# Altium schematic sheet GE-PHY.SchDoc
size A4
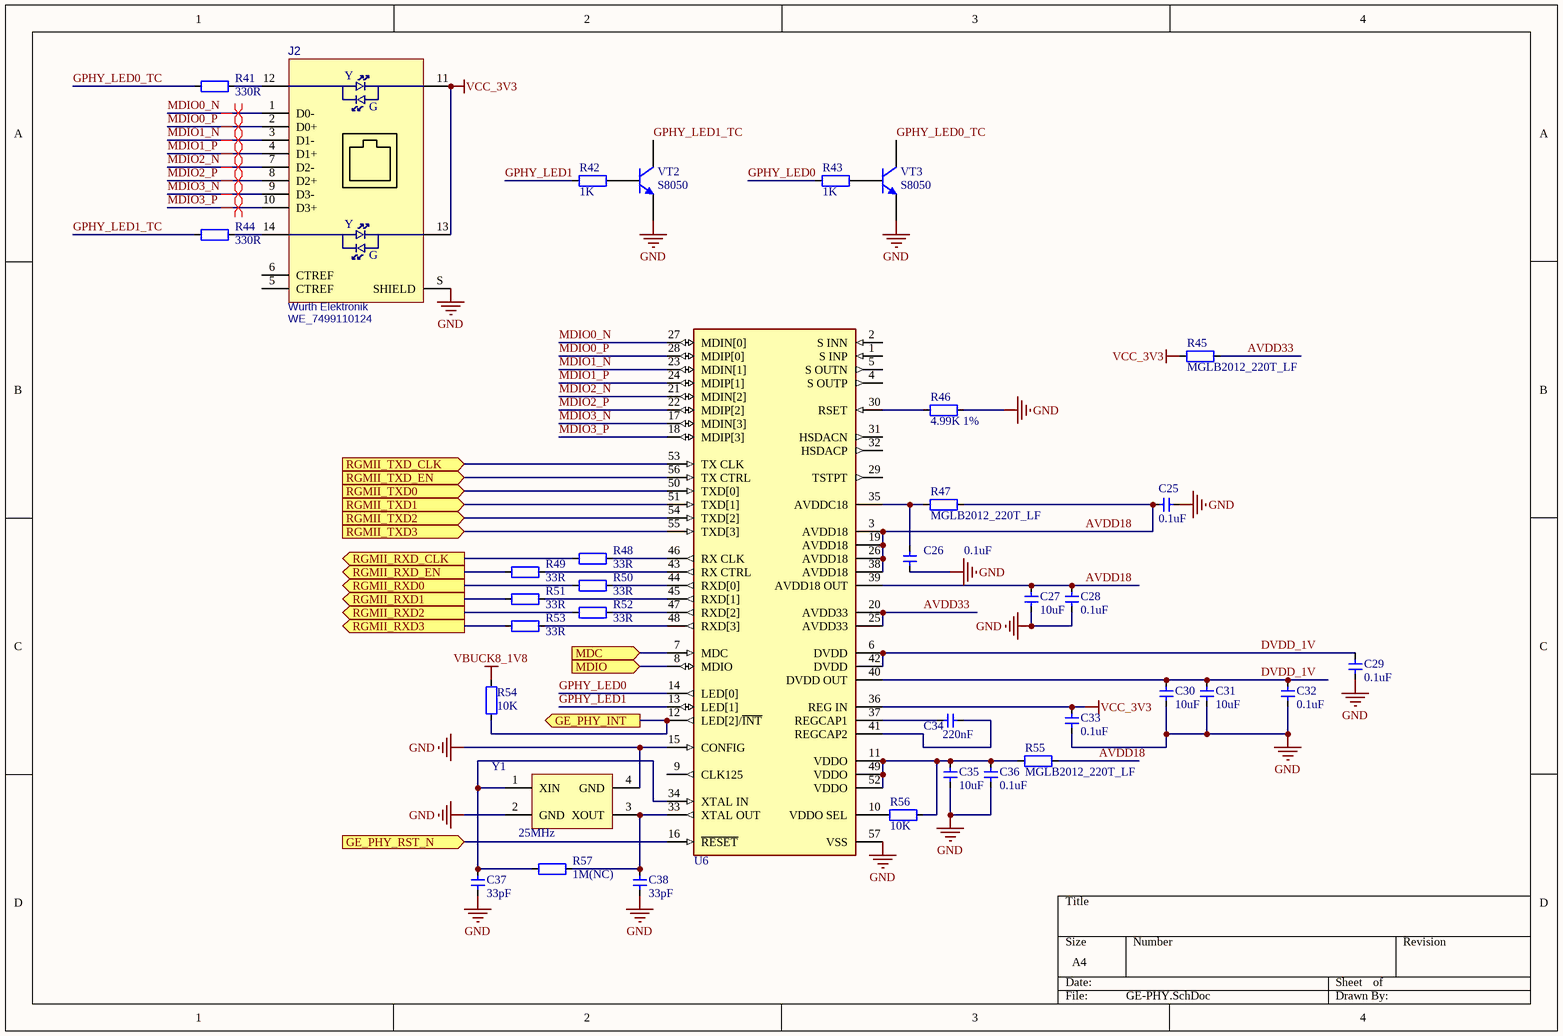
[diagram p0: GE-PHY.SchDoc]

## Parts
C25  0.1uF  [CAP_0402]
C26  0.1uF  [CAP_0402]
C27  10uF  [CAP_0402]
C28  0.1uF  [CAP_0402]
C29  0.1uF  [CAP_0402]
C30  10uF  [CAP_0402]
C31  10uF  [CAP_0402]
C32  0.1uF  [CAP_0402]
C33  0.1uF  [CAP_0402]
C34  220nF  [CAP_0402]
C35  10uF  [CAP_0402]
C36  0.1uF  [CAP_0402]
C37  33pF  [CAP_0402]
C38  33pF  [CAP_0402]
J2  Manufacturer: Wurth Elektronik  [GE-SOCKET]  (hidden comment: WE_7499110124)
R41  330R  [RES_0402]
R42  1K  [RES_0402]
R43  1K  [RES_0402]
R44  330R  [RES_0402]
R45  MGLB2012_220T_LF  [0805-L]
R46  4.99K 1%  [RES_0402]
R47  MGLB2012_220T_LF  [0805-L]
R48  33R  [RES_0402]
R49  33R  [RES_0402]
R50  33R  [RES_0402]
R51  33R  [RES_0402]
R52  33R  [RES_0402]
R53  33R  [RES_0402]
R54  10K  [RES_0402]
R55  MGLB2012_220T_LF  [0805-L]
R56  10K  [RES_0402]
R57  1M(NC)  [RES_0402]
U6  88E1512-A0-NNP2I000  [QFN-56]  (value not drawn)
VT2  S8050  [SMT_TRIODE_NPN]
VT3  S8050  [SMT_TRIODE_NPN]
Y1  25MHz  [晶振2520]

## Ports
GE_PHY_INT (out), GE_PHY_RST_N (in), MDC (in), MDIO (in), RGMII_RXD0 (out), RGMII_RXD1 (out), RGMII_RXD2 (out), RGMII_RXD3 (out), RGMII_RXD_CLK (out), RGMII_RXD_EN (out), RGMII_TXD0 (in), RGMII_TXD1 (in), RGMII_TXD2 (in), RGMII_TXD3 (in), RGMII_TXD_CLK (in), RGMII_TXD_EN (in)

## Nets
GND: C25.2 C26.1 C27.2 C28.2 C29.2 C30.2 C31.2 C32.2 C33.2 C35.2 C36.2 C37.2 C38.2 J2.S(SHIELD) R46.2 U6.15(CONFIG) U6.57(VSS) VT2.2(E) VT3.2(E) Y1.2(GND) Y1.4(GND)
VBUCK8_1V8: R54.1
VCC_3V3: C33.1 J2.11 J2.13 R45.1 U6.36(REG_IN)
AVDD18: C25.1 C27.1 C28.1 R47.2 R55.2 U6.3(AVDD18) U6.19(AVDD18) U6.26(AVDD18) U6.38(AVDD18) U6.39(AVDD18_OUT)
AVDD33: R45.2 U6.20(AVDD33) U6.25(AVDD33)
DVDD_1V: C29.1 C30.1 C31.1 C32.1 U6.6(DVDD) U6.40(DVDD_OUT) U6.42(DVDD)
GE_PHY_INT: R54.2 U6.12(LED[2]/~{INT}) ; port GE_PHY_INT
GE_PHY_RST_N: U6.16(~{RESET}) ; port GE_PHY_RST_N
GPHY_LED0: R43.1 U6.14(LED[0])
GPHY_LED0_TC: R41.2 VT3.3(C)
GPHY_LED1: R42.1 U6.13(LED[1])
GPHY_LED1_TC: R44.2 VT2.3(C)
MDC: U6.7(MDC) ; port MDC
MDIO: U6.8(MDIO) ; port MDIO
MDIO0_N: J2.1(D0-) U6.27(MDIN[0])
MDIO0_P: J2.2(D0+) U6.28(MDIP[0])
MDIO1_N: J2.3(D1-) U6.23(MDIN[1])
MDIO1_P: J2.4(D1+) U6.24(MDIP[1])
MDIO2_N: J2.7(D2-) U6.21(MDIN[2])
MDIO2_P: J2.8(D2+) U6.22(MDIP[2])
MDIO3_N: J2.9(D3-) U6.17(MDIN[3])
MDIO3_P: J2.10(D3+) U6.18(MDIP[3])
RGMII_RXD0: R50.2 ; port RGMII_RXD0
RGMII_RXD1: R51.2 ; port RGMII_RXD1
RGMII_RXD2: R52.2 ; port RGMII_RXD2
RGMII_RXD3: R53.2 ; port RGMII_RXD3
RGMII_RXD_CLK: R48.2 ; port RGMII_RXD_CLK
RGMII_RXD_EN: R49.2 ; port RGMII_RXD_EN
RGMII_TXD0: U6.50(TXD[0]) ; port RGMII_TXD0
RGMII_TXD1: U6.51(TXD[1]) ; port RGMII_TXD1
RGMII_TXD2: U6.54(TXD[2]) ; port RGMII_TXD2
RGMII_TXD3: U6.55(TXD[3]) ; port RGMII_TXD3
RGMII_TXD_CLK: U6.53(TX_CLK) ; port RGMII_TXD_CLK
RGMII_TXD_EN: U6.56(TX_CTRL) ; port RGMII_TXD_EN
NetC26_2: C26.2 R47.1 U6.35(AVDDC18)
NetC34_1: C34.1 U6.37(REGCAP1)
NetC34_2: C34.2 U6.41(REGCAP2)
NetC35_1: C35.1 C36.1 R55.1 R56.2 U6.11(VDDO) U6.49(VDDO) U6.52(VDDO)
NetC37_1: C37.1 R57.2 U6.34(XTAL_IN) Y1.1(XIN)
NetC38_1: C38.1 R57.1 U6.33(XTAL_OUT) Y1.3(XOUT)
NetJ2_12: J2.12 R41.1
NetJ2_14: J2.14 R44.1
NetR42_2: R42.2 VT2.1(B)
NetR43_2: R43.2 VT3.1(B)
NetR46_1: R46.1 U6.30(RSET)
NetR48_1: R48.1 U6.46(RX_CLK)
NetR49_1: R49.1 U6.43(RX_CTRL)
NetR50_1: R50.1 U6.44(RXD[0])
NetR51_1: R51.1 U6.45(RXD[1])
NetR52_1: R52.1 U6.47(RXD[2])
NetR53_1: R53.1 U6.48(RXD[3])
NetR56_1: R56.1 U6.10(VDDO_SEL)

Not connected (* = marked no-connect by the designer): J2 5(CTREF) 6(CTREF); U6 1(S_INP) 2(S_INN) 4(S_OUTP) 5(S_OUTN) 9(CLK125) 29(TSTPT) 31(HSDACN) 32(HSDACP)

## Layout directives
differential pair: MDIO0_N, MDIO0_P, MDIO1_N, MDIO1_P, MDIO2_N, MDIO2_P, MDIO3_N, MDIO3_P

## Notes on the sheet
- (in symbol GE-SOCKET) Y; G

## Library data of the parts
C25-C38 = 电容-0402: Capacitor; Value: 0.1u
J2 = GE-SOCKET: LAN-Transformer WE-RJ45LAN 10/100/1000 BaseT; PartNumber: WE_7499110124; Value: WE_7499110124; PartSymbol: WE_7499110124
R41-R44 R46 R48-R54 R56 R57 = 电阻-0402: Resistor; Value: 22R
R45 R47 R55 = 电阻-0805: Resistor; Value: 22R
VT2 VT3 = SMT_TRIODE_NPN: Surface mount NPN transistor, package SOT-23
Y1 = 晶振-4Pin-无源: 2520无源; MF: ECS International; MP: ECS-3225S30-240-EN-TR; Package: SMD-6 ECS International; Price: 0.75 USD; Availability: Unavailable; Value: *